# Altium schematic sheet 29 Other Pwr 1.SchDoc
size 420 x 297 mm
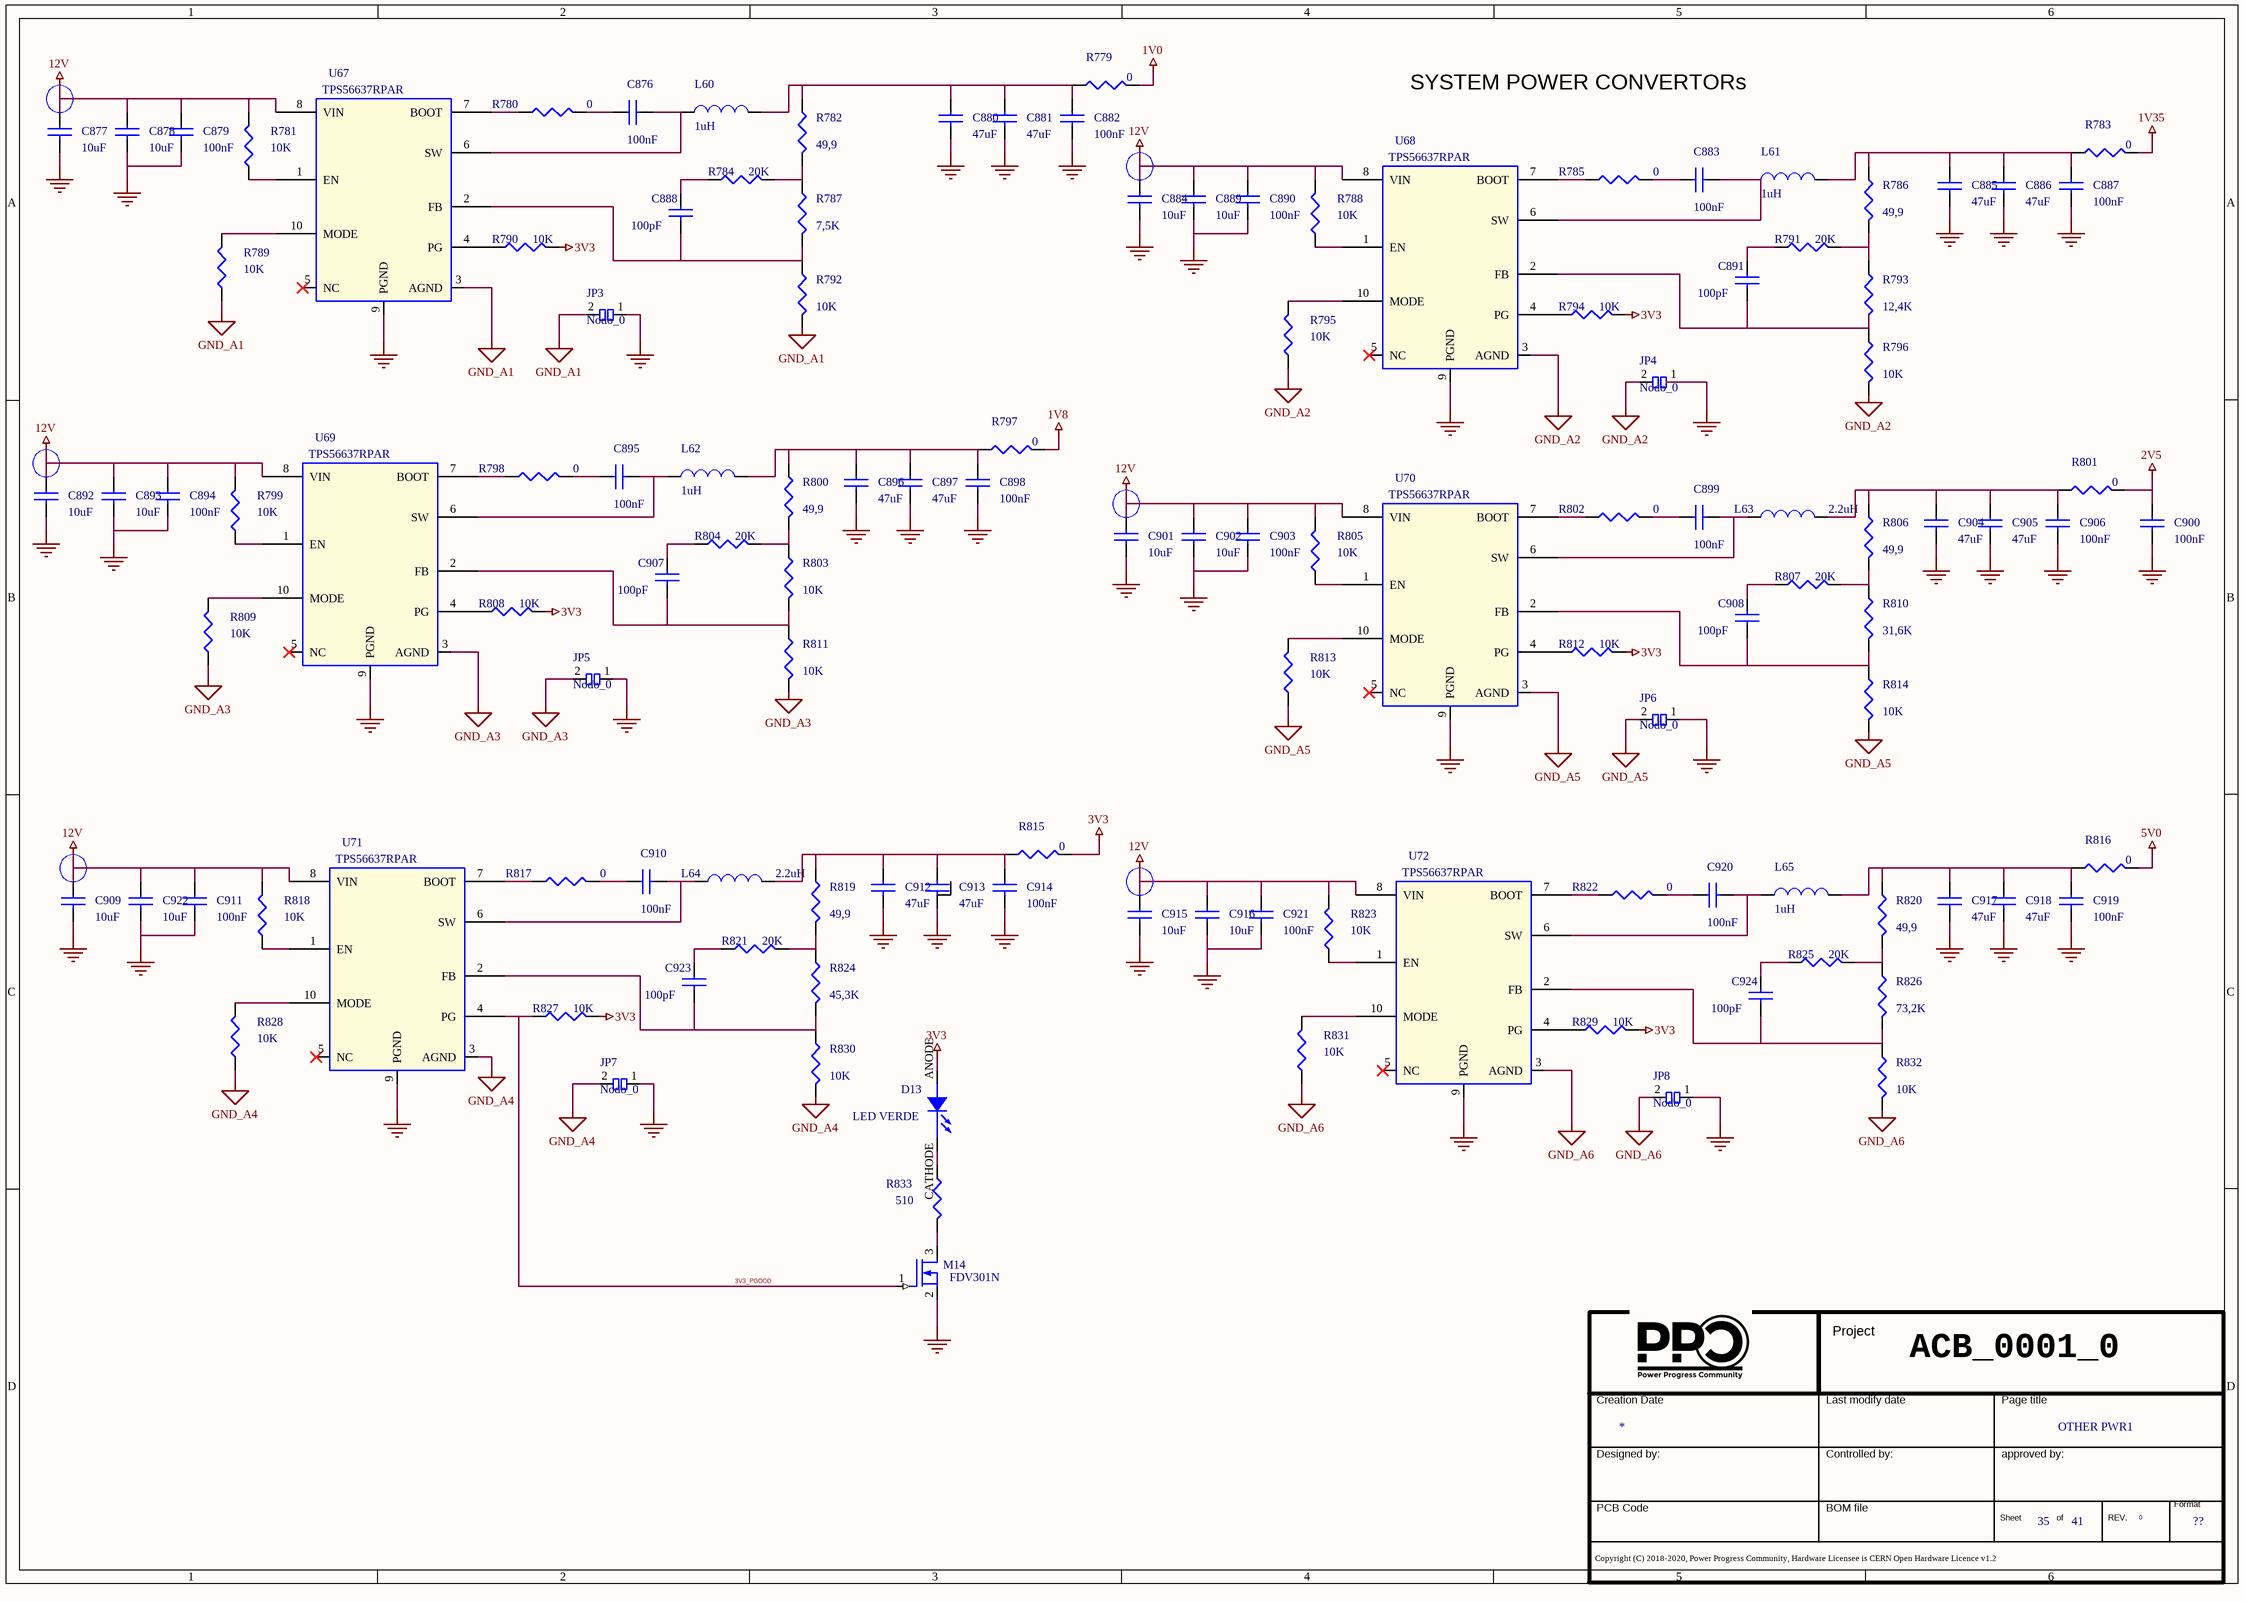
[diagram p0: 29 Other Pwr 1.SchDoc]

## Parts
*  Doc: OTHER PWR1  Page Count: 41  Page Number: 35  Page Size: ??  RevCode: 0  (hidden comment: Title_block_PPC)  (graphical)
C876  100nF  [SMD_0402]
C877  10uF  [SMD_0603]
C878  10uF  [SMD_0603]
C879  100nF  [SMD_0402]
C880  47uF  [SMD_0805]
C881  47uF  [SMD_0805]
C882  100nF  [SMD_0402]
C883  100nF  [SMD_0402]
C884  10uF  [SMD_0603]
C885  47uF  [SMD_0805]
C886  47uF  [SMD_0805]
C887  100nF  [SMD_0402]
C888  100pF  [SMD_0402]
C889  10uF  [SMD_0603]
C890  100nF  [SMD_0402]
C891  100pF  [SMD_0402]
C892  10uF  [SMD_0603]
C893  10uF  [SMD_0603]
C894  100nF  [SMD_0402]
C895  100nF  [SMD_0402]
C896  47uF  [SMD_0805]
C897  47uF  [SMD_0805]
C898  100nF  [SMD_0402]
C899  100nF  [SMD_0402]
C900  100nF  [SMD_0402]
C901  10uF  [SMD_0603]
C902  10uF  [SMD_0603]
C903  100nF  [SMD_0402]
C904  47uF  [SMD_0805]
C905  47uF  [SMD_0805]
C906  100nF  [SMD_0402]
C907  100pF  [SMD_0402]
C908  100pF  [SMD_0402]
C909  10uF  [SMD_0603]
C910  100nF  [SMD_0402]
C911  100nF  [SMD_0402]
C912  47uF  [SMD_0805]
C913  47uF  [SMD_0805]
C914  100nF  [SMD_0402]
C915  10uF  [SMD_0603]
C916  10uF  [SMD_0603]
C917  47uF  [SMD_0805]
C918  47uF  [SMD_0805]
C919  100nF  [SMD_0402]
C920  100nF  [SMD_0402]
C921  100nF  [SMD_0402]
C922  10uF  [SMD_0603]
C923  100pF  [SMD_0402]
C924  100pF  [SMD_0402]
D13  LED VERDE  [led_0603]
JP3  Nodo_0
JP4  Nodo_0
JP5  Nodo_0
JP6  Nodo_0
JP7  Nodo_0
JP8  Nodo_0
L60  1uH  [SMD]
L61  1uH  [SMD]
L62  1uH  [SMD]
L63  2.2uH  [SMD]
L64  2.2uH  [SMD]
L65  1uH  [SMD]
M14  FDV301N  [sot23]
R779  0  [SMD_1206]
R780  0  [SMD_0402]
R781  10K  [SMD_0402]
R782  49,9  [SMD_0402]
R783  0  [SMD_1206]
R784  20K  [SMD_0402]
R785  0  [SMD_0402]
R786  49,9  [SMD_0402]
R787  7,5K  [SMD_0402]
R788  10K  [SMD_0402]
R789  10K  [SMD_0402]
R790  10K  [SMD_0402]
R791  20K  [SMD_0402]
R792  10K  [SMD_0402]
R793  12,4K  [SMD_0402]
R794  10K  [SMD_0402]
R795  10K  [SMD_0402]
R796  10K  [SMD_0402]
R797  0  [SMD_1206]
R798  0  [SMD_0402]
R799  10K  [SMD_0402]
R800  49,9  [SMD_0402]
R801  0  [SMD_1206]
R802  0  [SMD_0402]
R803  10K  [SMD_0402]
R804  20K  [SMD_0402]
R805  10K  [SMD_0402]
R806  49,9  [SMD_0402]
R807  20K  [SMD_0402]
R808  10K  [SMD_0402]
R809  10K  [SMD_0402]
R810  31,6K  [SMD_0402]
R811  10K  [SMD_0402]
R812  10K  [SMD_0402]
R813  10K  [SMD_0402]
R814  10K  [SMD_0402]
R815  0  [SMD_1206]
R816  0  [SMD_1206]
R817  0  [SMD_0402]
R818  10K  [SMD_0402]
R819  49,9  [SMD_0402]
R820  49,9  [SMD_0402]
R821  20K  [SMD_0402]
R822  0  [SMD_0402]
R823  10K  [SMD_0402]
R824  45,3K  [SMD_0402]
R825  20K  [SMD_0402]
R826  73,2K  [SMD_0402]
R827  10K  [SMD_0402]
R828  10K  [SMD_0402]
R829  10K  [SMD_0402]
R830  10K  [SMD_0402]
R831  10K  [SMD_0402]
R832  10K  [SMD_0402]
R833  510  [SMD_0402]
U67  TPS56637RPAR  [VQFN10]
U68  TPS56637RPAR  [VQFN10]
U69  TPS56637RPAR  [VQFN10]
U70  TPS56637RPAR  [VQFN10]
U71  TPS56637RPAR  [VQFN10]
U72  TPS56637RPAR  [VQFN10]

## Nets
1V0: R779.2
1V8: R797.2
1V35: R783.2
2V5: C900.1 R801.2
3V3: D13.ANODE R790.2 R794.2 R808.2 R812.2 R815.2 R827.2 R829.2
5V0: R816.2
12V: C877.1 C878.1 C879.1 C884.1 C889.1 C890.1 C892.1 C893.1 C894.1 C901.1 C902.1 C903.1 C909.1 C911.1 C915.1 C916.1 C921.1 C922.1 R781.2 R788.2 R799.2 R805.2 R818.2 R823.2 U67.8(VIN) U68.8(VIN) U69.8(VIN) U70.8(VIN) U71.8(VIN) U72.8(VIN)
GND: C877.2 C878.2 C879.2 C880.2 C881.2 C882.2 C884.2 C885.2 C886.2 C887.2 C889.2 C890.2 C892.2 C893.2 C894.2 C896.2 C897.2 C898.2 C900.2 C901.2 C902.2 C903.2 C904.2 C905.2 C906.2 C909.2 C911.2 C912.2 C913.2 C914.2 C915.2 C916.2 C917.2 C918.2 C919.2 C921.2 C922.2 JP3.1 JP4.1 JP5.1 JP6.1 JP7.1 JP8.1 M14.2(SOURCE) U67.9(PGND) U68.9(PGND) U69.9(PGND) U70.9(PGND) U71.9(PGND) U72.9(PGND)
GND_A1: JP3.2 R789.1 R792.2 U67.3(AGND)
GND_A2: JP4.2 R795.1 R796.2 U68.3(AGND)
GND_A3: JP5.2 R809.1 R811.2 U69.3(AGND)
GND_A4: JP7.2 R828.1 R830.2 U71.3(AGND)
GND_A5: JP6.2 R813.1 R814.2 U70.3(AGND)
GND_A6: JP8.2 R831.1 R832.2 U72.3(AGND)
3V3_PGOOD: M14.1(GATE) R827.1 U71.4(PG)
NetC876_1: C876.1 R780.2
NetC876_2: C876.2 L60.1 U67.6(SW)
NetC880_1: C880.1 C881.1 C882.1 L60.2 R779.1 R782.1
NetC883_1: C883.1 R785.2
NetC883_2: C883.2 L61.1 U68.6(SW)
NetC885_1: C885.1 C886.1 C887.1 L61.2 R783.1 R786.1
NetC888_1: C888.1 R784.1
NetC888_2: C888.2 R787.2 R792.1 U67.2(FB)
NetC891_1: C891.1 R791.1
NetC891_2: C891.2 R793.2 R796.1 U68.2(FB)
NetC895_1: C895.1 R798.2
NetC895_2: C895.2 L62.1 U69.6(SW)
NetC896_1: C896.1 C897.1 C898.1 L62.2 R797.1 R800.1
NetC899_1: C899.1 R802.2
NetC899_2: C899.2 L63.1 U70.6(SW)
NetC904_1: C904.1 C905.1 C906.1 L63.2 R801.1 R806.1
NetC907_1: C907.1 R804.1
NetC907_2: C907.2 R803.2 R811.1 U69.2(FB)
NetC908_1: C908.1 R807.1
NetC908_2: C908.2 R810.2 R814.1 U70.2(FB)
NetC910_1: C910.1 R817.2
NetC910_2: C910.2 L64.1 U71.6(SW)
NetC912_1: C912.1 C913.1 C914.1 L64.2 R815.1 R819.1
NetC917_1: C917.1 C918.1 C919.1 L65.2 R816.1 R820.1
NetC920_1: C920.1 R822.2
NetC920_2: C920.2 L65.1 U72.6(SW)
NetC923_1: C923.1 R821.1
NetC923_2: C923.2 R824.2 R830.1 U71.2(FB)
NetC924_1: C924.1 R825.1
NetC924_2: C924.2 R826.2 R832.1 U72.2(FB)
NetD13_CATHODE: D13.CATHODE R833.2
NetM14_3: M14.3(DRAIN) R833.1
NetR780_1: R780.1 U67.7(BOOT)
NetR781_1: R781.1 U67.1(EN)
NetR782_2: R782.2 R784.2 R787.1
NetR785_1: R785.1 U68.7(BOOT)
NetR786_2: R786.2 R791.2 R793.1
NetR788_1: R788.1 U68.1(EN)
NetR789_2: R789.2 U67.10(MODE)
NetR790_1: R790.1 U67.4(PG)
NetR794_1: R794.1 U68.4(PG)
NetR795_2: R795.2 U68.10(MODE)
NetR798_1: R798.1 U69.7(BOOT)
NetR799_1: R799.1 U69.1(EN)
NetR800_2: R800.2 R803.1 R804.2
NetR802_1: R802.1 U70.7(BOOT)
NetR805_1: R805.1 U70.1(EN)
NetR806_2: R806.2 R807.2 R810.1
NetR808_1: R808.1 U69.4(PG)
NetR809_2: R809.2 U69.10(MODE)
NetR812_1: R812.1 U70.4(PG)
NetR813_2: R813.2 U70.10(MODE)
NetR817_1: R817.1 U71.7(BOOT)
NetR818_1: R818.1 U71.1(EN)
NetR819_2: R819.2 R821.2 R824.1
NetR820_2: R820.2 R825.2 R826.1
NetR822_1: R822.1 U72.7(BOOT)
NetR823_1: R823.1 U72.1(EN)
NetR828_2: R828.2 U71.10(MODE)
NetR829_1: R829.1 U72.4(PG)
NetR831_2: R831.2 U72.10(MODE)

Not connected (* = marked no-connect by the designer): U67 5(NC)*; U68 5(NC)*; U69 5(NC)*; U70 5(NC)*; U71 5(NC)*; U72 5(NC)*

## Notes on the sheet
- SYSTEM POWER CONVERTORs
- ACB_0001_0
- (in symbol Title_block_PPC) Project; Creation Date; Last modify date; Page title; Designed by:; Controlled by:; approved by:; Format; PCB Code; BOM file; Sheet; of; REV.; Copyright (C) 2018-2020, Power Progress Community, Hardware Licensee is CERN Open Hardware Licence v1.2

## Library data of the parts
* = Title_block_PPC: Title: T2080PCIe; Schematic Page Count: 45; Schematic Page Number: 39; Author: MICETEK; Page Create Date: March  8, 1995; Page Title: ?; Page Modify Date: *
C876 C882 C883 C895 C899 C910 C920 = CAP NP_Dup2: COND.CER. 100NF 50V 0402 X7R SMD; Part Number: PASSIVE_24; Manufacturer 1: TDK; Manufacturer Part Number 1: CGA2B3X7R1H104M050BD; RSM: RC0402; Part Type: Capacitors\Ceramic\SMD\0402; PCB Footprint: SMD_0402
C877 C878 C889 C892 C893 C901 C902 C909 C915 C916 C922 = CAP NP_Dup2: COND.CER.10uF 0603 25V SMD; Manufacturer Part Number 1: CL10A106MA8NRNC; Manufacturer 1: SAMSUNG; Part Number: PASSIVE_124; RSM: RC0603; Part Type: Capacitors\Ceramic\SMD\0603; PCB Footprint: SMD_0603
C879 C887 C890 C894 C898 C900 C903 C906 C911 C914 C919 C921 = CAP NP_Dup2: COND.CER. 100NF 50V 0402 X7R SMD; Manufacturer Part Number 1: CGA2B3X7R1H104M050BD; Manufacturer 1: TDK; Part Number: PASSIVE_24; RSM: RC0402; Part Type: Capacitors\Ceramic\SMD\0402; PCB Footprint: SMD_0402
C880 C886 C897 C905 C913 C918 = CAP NP_Dup2: CAP CER 47UF 10V 20% X5R 0805; Manufacturer Part Number 1: JMK212BJ476MG-T; Manufacturer 1: Taiyo Yuden; Part Number: PASSIVE_244; RSM: RC0805; Part Type: Capacitors\Ceramic\SMD\0805; PCB Footprint: SMD_0805
C881 C885 C896 C904 C912 C917 = CAP NP_Dup2: CAP CER 47UF 10V 20% X5R 0805; Part Number: PASSIVE_244; Manufacturer 1: Taiyo Yuden; Manufacturer Part Number 1: JMK212BJ476MG-T; RSM: RC0805; Part Type: Capacitors\Ceramic\SMD\0805; PCB Footprint: SMD_0805
C884 = CAP NP_Dup2: COND.CER.10uF 0603 25V SMD; Part Number: PASSIVE_124; Manufacturer 1: SAMSUNG; Manufacturer Part Number 1: CL10A106MA8NRNC; RSM: RC0603; Part Type: Capacitors\Ceramic\SMD\0603; PCB Footprint: SMD_0603
C888 C891 C907 C908 C923 C924 = CAP NP_Dup2: COND.CER. 100PF 50V 0402 NPO 5% SMD; Part Number: PASSIVE_26; Manufacturer 1: Murata; Manufacturer Part Number 1: GRM1555C1H101JD01D; RSM: RC0402; Part Type: Capacitors\Ceramic\SMD\0402; PCB Footprint: SMD_0402
D13 = LED_1: LED CHIPLED VERDE 40mcd 570nm; Manufacturer Part Number 1: 598-8070-107F; Manufacturer 1: DIALIGHT; Part Number: DISCRETE_31; PCB Footprint: SMD_0603; RSM: LED0603-AK; Distributor 1: MOUSER(645-598-8070-107F); Part Type: Diodes\LED; TYPE: LED
JP3 JP5 JP6 = JUMPER_0: Serve solo al masterista per collegare i gnd; LNK_PART: SEZ0201_CHIUSO; Part Number: DA CODIFICARE; TECNO77: NODO; Part Type: NODO; RSM: NODO
JP4 JP7 JP8 = JUMPER_0: Serve solo al masterista per collegare i gnd; Part Number: DA CODIFICARE; LNK_PART: SEZ0201_CHIUSO; RSM: NODO; Part Type: NODO; TECNO77: NODO
L60-L62 L65 = INDUCTOR_Dup1: FIXED IND 1UH 11A 16.5 Mohm SMD; Manufacturer Part Number 1: IHLP2525CZER1R0M01; Manufacturer 1: Vishay; Part Number: PASSIVE_1467; RSM: IND-VISHAY-IHLP2525; Part Type: Inductors\SMD\IHLP2525; PCB Footprint: SMD
L63 L64 = INDUCTOR_Dup1: FIXED IND 2.2UH 7A 16.5 Mohm SMD; Part Number: PASSIVE_513; Manufacturer 1: Vishay; Manufacturer Part Number 1: IHLP2525CZER2R2M1; RSM: IND-VISHAY-IHLP2525; Part Type: Inductors\SMD\IHLP2525; PCB Footprint: SMD
M14 = NMOS_SOT23: FDV301N N CHANNEL DIGITAL FET; Part Number: DISCRETE_196; Manufacturer 1: FAIRCHILD; Manufacturer Part Number 1: FDV301N  (ROHS COMPLIANT); RSM: SOT-23; Part Type: Mosfet\SOT23; Distributor 1: CLAITRON LASI SILVESTAR S.R.L; PCB Footprint: sot23
R779 = R_Dup5: RESIS. 0R 1/4W 1206 SMD E96; Part Number: PASSIVE_1266; Manufacturer 1: YAGEO; Manufacturer Part Number 1: RC1206JR-070RL; RSM: RC1206; Part Type: Resistors\Fixed\SMD\1206\5%; PCB Footprint: SMD_1206
R780 R785 R798 R802 R817 R822 = R_Dup5: RESIS.CHIP 0R 5% 0402 SMD; Manufacturer 1: ROYAL OHM; Part Number: PASSIVE_805; RSM: RC0402; Manufacturer Part Number 1: RESIS.CHIP 0R 5% 0402 SMD; Part Type: Resistors\Fixed\SMD\0402\5%; PCB Footprint: SMD_0402
R781 R788 R789 R795 R799 R805 R809 R813 R818 R823 R827 R828 R831 = R_Dup5: RESIS.CHIP 10K 1% 0402 SMD; Manufacturer 1: ROYAL OHM; Part Number: PASSIVE_584; RSM: RC0402; Manufacturer Part Number 1: RESIS.CHIP 10K 1% 0402 SMD; Part Type: Resistors\Fixed\SMD\0402\1%; PCB Footprint: SMD_0402
R782 R786 R800 R806 R819 R820 = R_Dup5: RESIS.CHIP 49,9R 1% 0402 SMD; Part Number: PASSIVE_738; Manufacturer 1: NIC; Manufacturer Part Number 1: NCR04F49R9TRF; RSM: RC0402; Part Type: Resistors\Fixed\SMD\0402\1%; PCB Footprint: SMD_0402
R783 R797 R801 R815 R816 = R_Dup5: RESIS. 0R 1/4W 1206 SMD E96; Manufacturer Part Number 1: RC1206JR-070RL; Manufacturer 1: YAGEO; Part Number: PASSIVE_1266; RSM: RC1206; Part Type: Resistors\Fixed\SMD\1206\5%; PCB Footprint: SMD_1206
R784 R791 R804 R807 R821 R825 = R_Dup5: RESIS.CHIP 20K 1% 0402 SMD; Manufacturer Part Number 1: RC0402FR-1320KL; Manufacturer 1: YAGEO; Part Number: PASSIVE_641; RSM: RC0402; Part Type: Resistors\Fixed\SMD\0402\1%; PCB Footprint: SMD_0402
R787 = R_Dup5: RES 7,5K OHM 1/10W 1% 0402 SMD; Manufacturer Part Number 1: CR0402-FX-7501GLF; Manufacturer 1: bourns; Part Number: PASSIVE_1468; RSM: RC0402; Part Type: Resistors\Fixed\SMD\0402\1%; PCB Footprint: SMD_0402
R790 R792 R794 R796 R803 R808 R811 R812 R814 R829 R830 R832 = R_Dup5: RESIS.CHIP 10K 1% 0402 SMD; Part Number: PASSIVE_584; Manufacturer 1: ROYAL OHM; RSM: RC0402; Part Type: Resistors\Fixed\SMD\0402\1%; Manufacturer Part Number 1: RESIS.CHIP 10K 1% 0402 SMD; PCB Footprint: SMD_0402
R793 = R_Dup5: RESIS.CHIP 12,4K 1% 0402 SMD; Manufacturer 1: ROYAL OHM; Part Number: PASSIVE_591; RSM: RC0402; Manufacturer Part Number 1: RESIS.CHIP 12,4K 1% 0402 SMD; Part Type: Resistors\Fixed\SMD\0402\1%; PCB Footprint: SMD_0402
R810 = R_Dup5: RESIS.CHIP 31,6K 1% 0402 SMD; Manufacturer Part Number 1: CRCW040231K6FKED; Manufacturer 1: Vishay/Dale; Part Number: PASSIVE_692; RSM: RC0402; Part Type: Resistors\Fixed\SMD\0402\1%; PCB Footprint: SMD_0402
R824 = R_Dup5: RESIS.CHIP 45,3K 1% 0402 SMD; Manufacturer Part Number 1: ERJ-2RKF4532X; Manufacturer 1: PANASONIC; Part Number: PASSIVE_731; RSM: RC0402; Part Type: Resistors\Fixed\SMD\0402\1%; PCB Footprint: SMD_0402
R826 = R_Dup5: RESIS.CHIP 73K2 1% 0402 SMD; Part Number: PASSIVE_781; Manufacturer 1: PANASONIC; Manufacturer Part Number 1: ERJ-2RKF7322X; RSM: RC0402; Part Type: Resistors\Fixed\SMD\0402\1%; PCB Footprint: SMD_0402
R833 = R_Dup5: RESIS.CHIP 510R 1% 0402 SMD; Part Number: PASSIVE_749; Manufacturer 1: ROYAL OHM; RSM: RC0402; Part Type: Resistors\Fixed\SMD\0402\1%; Manufacturer Part Number 1: RESIS.CHIP 510R 1% 0402 SMD; PCB Footprint: SMD_0402
U67-U72 = TPS56637: 4.5-V to 28-V input, 6-A synchronous buck; Manufacturer 1: TEXAS; Part Number: LINEAR_330; RSM: VQFN-10-3_1X3_1; Distributor 1: MOUSER(595-TPS56637RPAR); Manufacturer Part Number 1: TPS56637RPAR; Part Type: Regulators\Switching; PCB Footprint: VQFN10